# Altium schematic sheet 单片机系统电路.SchDoc
size A4; Time: 22/04/06
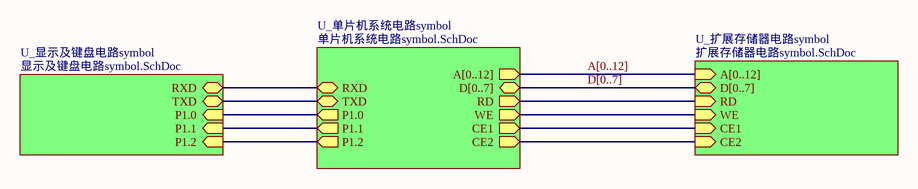
[diagram p0: 单片机系统电路.SchDoc]

## Sub-sheets
U_单片机系统电路symbol = 单片机系统电路symbol.SchDoc: RXD (bidir), TXD (bidir), P1.0 (out), P1.1 (out), P1.2 (out), A[0..12] (out), D[0..7] (bidir), RD (out), WE (out), CE1 (out), CE2 (out)
U_扩展存储器电路symbol = 扩展存储器电路symbol.SchDoc: A[0..12] (in), D[0..7] (bidir), RD (in), WE (in), CE1 (in), CE2 (in)
U_显示及键盘电路symbol = 显示及键盘电路symbol.SchDoc: RXD (bidir), TXD (bidir), P1.0 (in), P1.1 (in), P1.2 (in)

## Nets
(unnamed): sheet U_单片机系统电路symbol/RXD, sheet U_显示及键盘电路symbol/RXD
(unnamed): sheet U_单片机系统电路symbol/TXD, sheet U_显示及键盘电路symbol/TXD
(unnamed): sheet U_单片机系统电路symbol/P1.0, sheet U_显示及键盘电路symbol/P1.0
(unnamed): sheet U_单片机系统电路symbol/P1.1, sheet U_显示及键盘电路symbol/P1.1
(unnamed): sheet U_单片机系统电路symbol/P1.2, sheet U_显示及键盘电路symbol/P1.2
(unnamed): sheet U_单片机系统电路symbol/RD, sheet U_扩展存储器电路symbol/RD
(unnamed): sheet U_单片机系统电路symbol/WE, sheet U_扩展存储器电路symbol/WE
(unnamed): sheet U_单片机系统电路symbol/CE1, sheet U_扩展存储器电路symbol/CE1
(unnamed): sheet U_单片机系统电路symbol/CE2, sheet U_扩展存储器电路symbol/CE2

## Buses and harness runs
bus A[0..12] = sheet U_单片机系统电路symbol/A[0..12] = sheet U_扩展存储器电路symbol/A[0..12]
bus D[0..7] = sheet U_单片机系统电路symbol/D[0..7] = sheet U_扩展存储器电路symbol/D[0..7]

## Notes on the sheet
- 专升本
- 通信工程
- 李烨攀
- 2101班
- 210806300163
- 学号